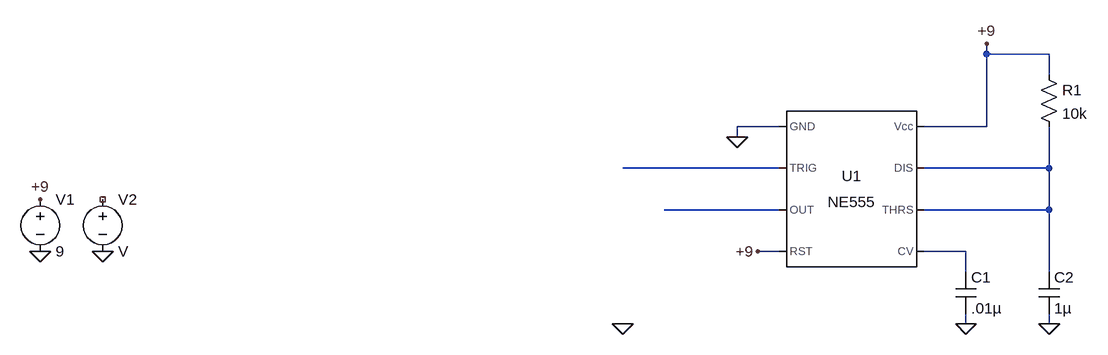
[diagram p0: schematic Snyth1 555 section.asc]
Snyth1 555 section.asc, the LTspice schematic file:
Version 4
SHEET 1 880 680
WIRE 192 -144 192 -160
WIRE 288 -144 192 -144
WIRE 288 -112 288 -144
WIRE -128 -32 -192 -32
WIRE 192 -32 192 -144
WIRE 192 -32 96 -32
WIRE -192 -16 -192 -32
WIRE -128 32 -368 32
WIRE 288 32 288 -32
WIRE 288 32 96 32
WIRE -128 96 -304 96
WIRE 288 96 288 32
WIRE 288 96 96 96
WIRE -128 160 -160 160
WIRE 160 160 96 160
WIRE 160 192 160 160
WIRE 288 192 288 96
WIRE 160 272 160 256
WIRE 288 272 288 256
FLAG -1264 160 0
FLAG -1168 160 0
FLAG -1264 80 +9
FLAG 192 -160 +9
FLAG 160 272 0
FLAG -192 -16 0
FLAG 288 272 0
FLAG -160 160 +9
FLAG -368 272 0
SYMBOL Misc\\NE555 -16 64 R0
SYMATTR InstName U1
SYMBOL voltage -1264 64 R0
WINDOW 123 0 0 Left 0
WINDOW 39 0 0 Left 0
SYMATTR InstName V1
SYMATTR Value 9
SYMBOL voltage -1168 64 R0
SYMATTR InstName V2
SYMBOL cap 144 192 R0
SYMATTR InstName C1
SYMATTR Value .01µ
SYMBOL res 272 -128 R0
SYMATTR InstName R1
SYMATTR Value 10k
SYMBOL cap 272 192 R0
SYMATTR InstName C2
SYMATTR Value 1µ

The netlist it stands for:
* Snyth1 555 section.asc
XU1 0 N001 N003 +9 N004 N002 N002 +9 NE555  ; pins GND TRIG OUT RST CV THRS DIS Vcc
V1 +9 0 9
V2 NC_01 0 V
C1 N004 0 .01µ
R1 +9 N002 10k
C2 N002 0 1µ
.lib NE555.sub
.backanno
.end